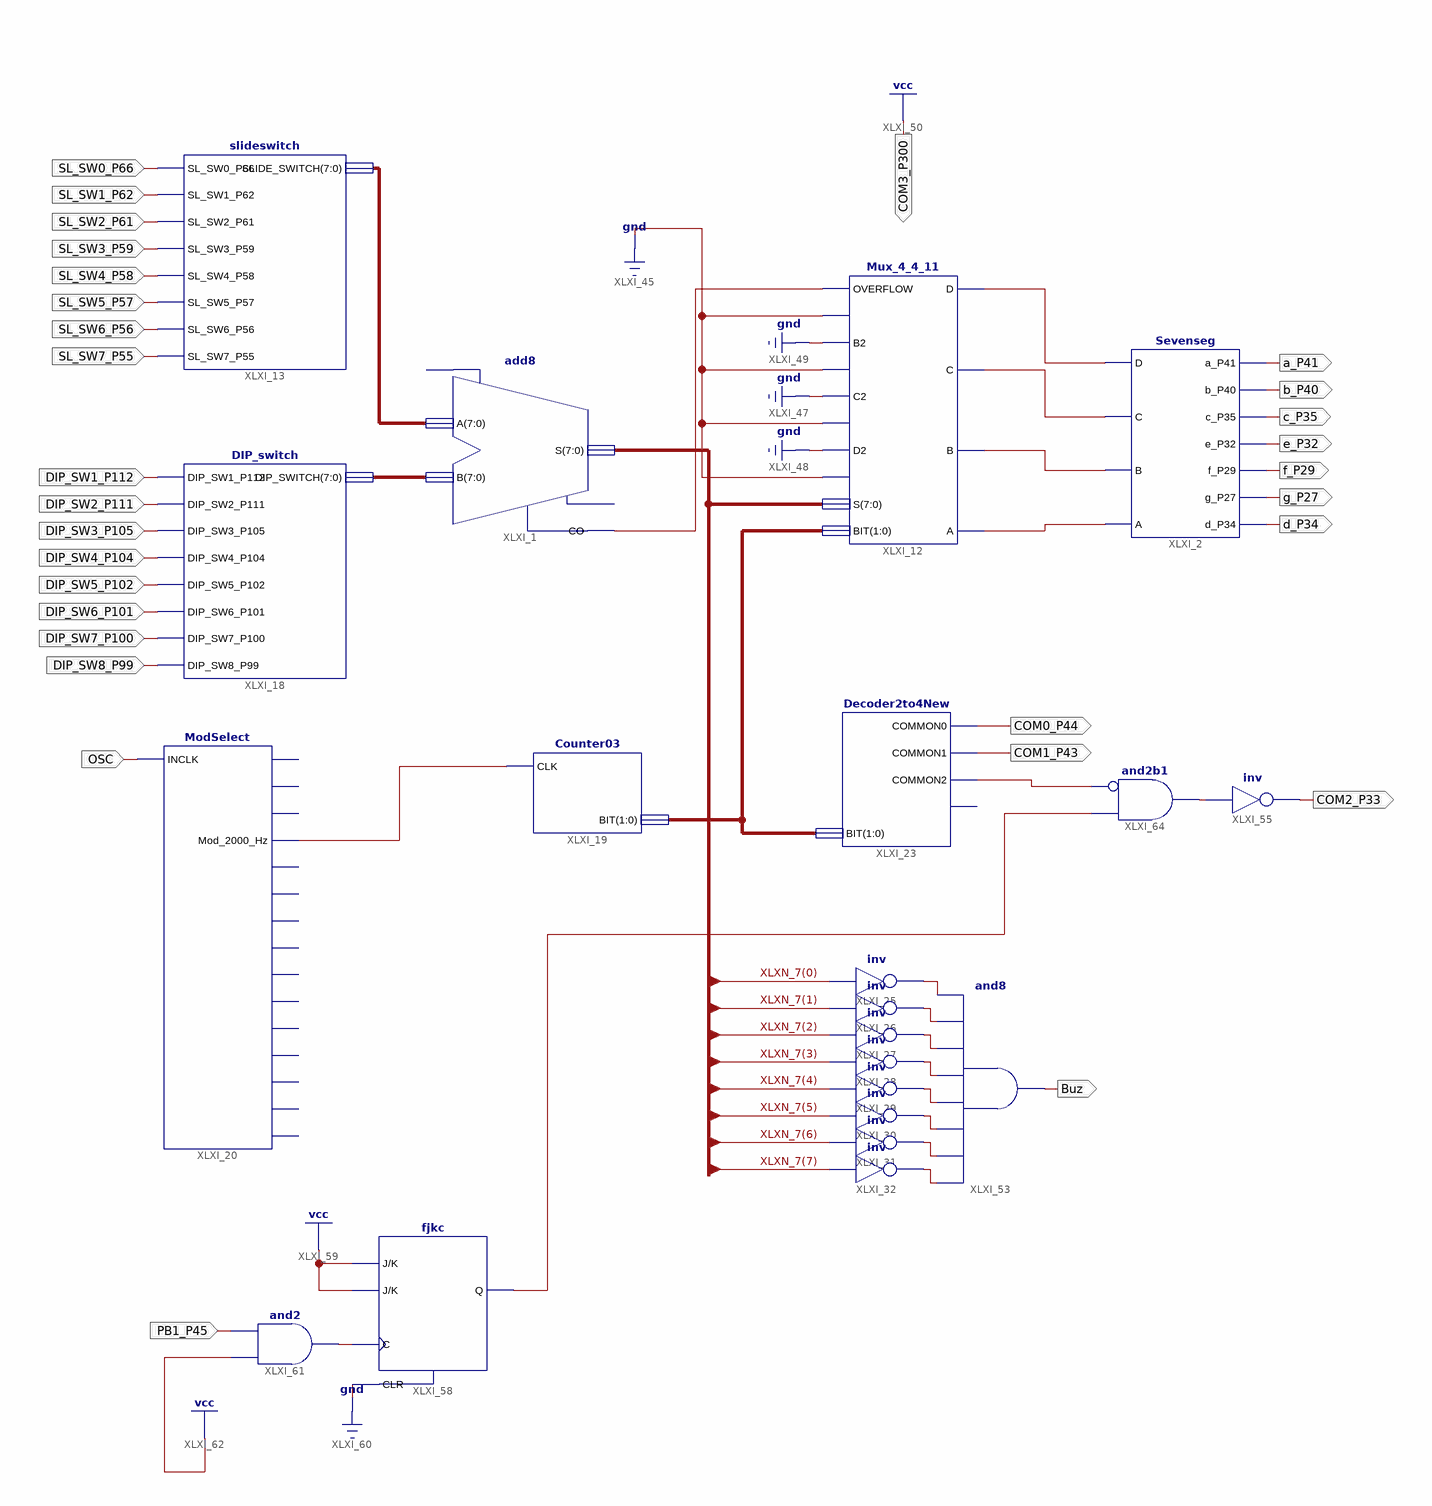
[diagram p0: schematic sheet 1]
// Xilinx ISE schematic Lab8.sch (spartan6) as structural Verilog: 21 symbols, 30 ports
module Lab8 (
  input  SL_SW0_P66,
  input  SL_SW1_P62,
  input  SL_SW2_P61,
  input  SL_SW3_P59,
  input  SL_SW4_P58,
  input  SL_SW5_P57,
  input  SL_SW6_P56,
  input  SL_SW7_P55,
  input  DIP_SW1_P112,
  input  DIP_SW2_P111,
  input  DIP_SW3_P105,
  input  DIP_SW4_P104,
  input  DIP_SW5_P102,
  input  DIP_SW6_P101,
  input  DIP_SW7_P100,
  input  DIP_SW8_P99,
  input  OSC,
  input  PB1_P45,
  output d_P34,
  output g_P27,
  output f_P29,
  output e_P32,
  output c_P35,
  output b_P40,
  output a_P41,
  output COM0_P44,
  output COM1_P43,
  output Buz,
  output COM3_P300,
  output COM2_P33
);

  wire XLXN_11, XLXN_12, XLXN_13, XLXN_14, XLXN_83, XLXN_91, XLXN_92, XLXN_93, XLXN_94, XLXN_95, XLXN_96,
       XLXN_97, XLXN_98, XLXN_163, XLXN_168, XLXN_169, XLXN_173, XLXN_176;
  wire [1:0] XLXN_85;
  wire [7:0] XLXN_7, XLXN_50, XLXN_73;

  Sevenseg XLXI_2 (
    .D(XLXN_14), .C(XLXN_13), .B(XLXN_12), .A(XLXN_11), .a_P41(a_P41), .b_P40(b_P40), .c_P35(c_P35),
    .e_P32(e_P32), .f_P29(f_P29), .g_P27(g_P27), .d_P34(d_P34));
  add8 XLXI_1 (.A(XLXN_50), .B(XLXN_73), .CO(XLXN_176), .S(XLXN_7));  // open: CI, OFL
  Mux_4_4_11 XLXI_12 (
    .OVERFLOW(XLXN_176), .A3(1'b0), .B2(1'b0), .B3(1'b0), .C2(1'b0), .C3(1'b0), .D2(1'b0), .D3(1'b0),
    .S(XLXN_7), .BIT(XLXN_85), .D(XLXN_14), .C(XLXN_13), .B(XLXN_12), .A(XLXN_11));
  slideswitch XLXI_13 (
    .SL_SW0_P66(SL_SW0_P66), .SL_SW1_P62(SL_SW1_P62), .SL_SW2_P61(SL_SW2_P61), .SL_SW3_P59(SL_SW3_P59),
    .SL_SW4_P58(SL_SW4_P58), .SL_SW5_P57(SL_SW5_P57), .SL_SW6_P56(SL_SW6_P56), .SL_SW7_P55(SL_SW7_P55),
    .SLIDE_SWITCH(XLXN_50));
  DIP_switch XLXI_18 (
    .DIP_SW1_P112(DIP_SW1_P112), .DIP_SW2_P111(DIP_SW2_P111), .DIP_SW3_P105(DIP_SW3_P105),
    .DIP_SW4_P104(DIP_SW4_P104), .DIP_SW5_P102(DIP_SW5_P102), .DIP_SW6_P101(DIP_SW6_P101),
    .DIP_SW7_P100(DIP_SW7_P100), .DIP_SW8_P99(DIP_SW8_P99), .DIP_SWITCH(XLXN_73));
  Counter03 XLXI_19 (.CLK(XLXN_83), .BIT(XLXN_85));
  ModSelect XLXI_20 (
    .INCLK(OSC), .Mod_2000_Hz(XLXN_83));  // open: Mod_2M_Hz, Mod_200K_Hz, Mod_20K_Hz, Mod_200_Hz, Mod_20_Hz, Mod_2_Hz, Mod_1_Hz, Mod_10_Hz, Mod_100_Hz, Mod_1000_Hz, Mod_10K_Hz, Mod_100K_Hz, Mod_1M_Hz, Mod_10M_Hz
  Decoder2to4New XLXI_23 (.COMMON0(COM0_P44), .COMMON1(COM1_P43), .COMMON2(XLXN_168), .BIT(XLXN_85));  // open: COMMON3
  not XLXI_25 (XLXN_91, XLXN_7[0]);
  not XLXI_26 (XLXN_92, XLXN_7[1]);
  not XLXI_27 (XLXN_93, XLXN_7[2]);
  not XLXI_28 (XLXN_94, XLXN_7[3]);
  not XLXI_29 (XLXN_95, XLXN_7[4]);
  not XLXI_30 (XLXN_96, XLXN_7[5]);
  not XLXI_31 (XLXN_97, XLXN_7[6]);
  not XLXI_32 (XLXN_98, XLXN_7[7]);
  and XLXI_53 (Buz, XLXN_98, XLXN_97, XLXN_96, XLXN_95, XLXN_94, XLXN_93, XLXN_92, XLXN_91);
  not XLXI_55 (COM2_P33, XLXN_163);
  fjkc XLXI_58 (.C(XLXN_173), .CLR(1'b0), .J(1'b1), .K(1'b1), .Q(XLXN_169));
  and XLXI_61 (XLXN_173, 1'b1, PB1_P45);
  and XLXI_64 (XLXN_163, ~XLXN_168, XLXN_169);  // and2b1

  assign COM3_P300 = 1'b1;
endmodule
